# EAGLE design working (EAGLE 9.2.1)
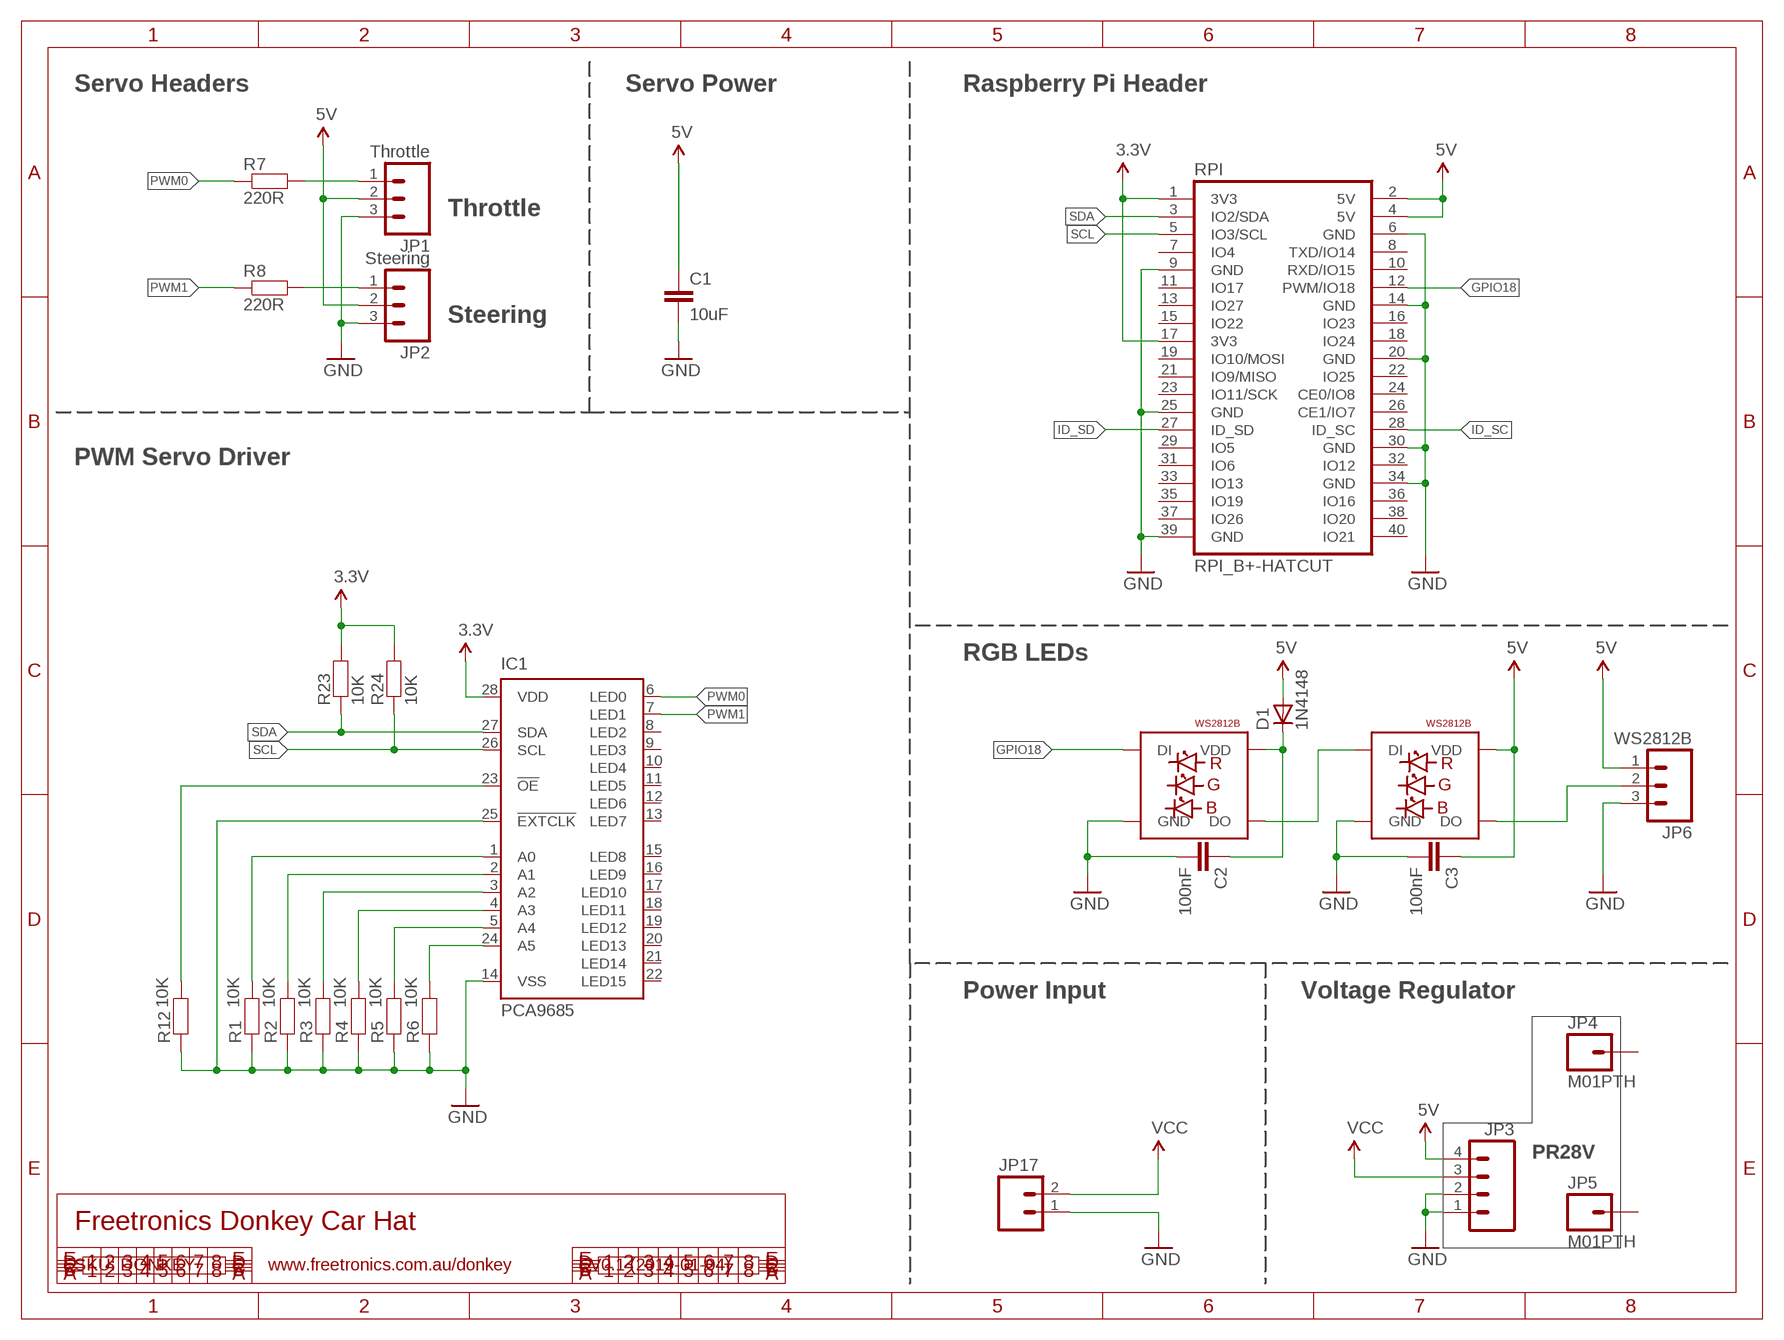
[diagram p0: schematic, sheet 1]

## Parts
C1  10uF  CAP0805  [0805]
C2  100nF  CAP0603  [0603]
C3  100nF  CAP0603  [0603]
D1  1N4148  DIODESOD  [SOD-323]
IC1  PCA9685  [TSSOP28]
JP1  Throttle  M03PTH  [1X03]
JP2  Steering  M03PTH  [1X03]
JP3  M04PTH  [1X04]
JP4  M01PTH  [1X01]
JP5  M01PTH  [1X01]
JP6  WS2812B  M03PTH  [1X03]
JP17  M025MM  [SCREWTERMINAL-5MM-2]
LED1  WS2812B5050  [WS2812B]
LED2  WS2812B5050  [WS2812B]
R1  10K  RESISTOR0603  [0603]
R2  10K  RESISTOR0603  [0603]
R3  10K  RESISTOR0603  [0603]
R4  10K  RESISTOR0603  [0603]
R5  10K  RESISTOR0603  [0603]
R6  10K  RESISTOR0603  [0603]
R7  220R  RESISTOR0603  [0603]
R8  220R  RESISTOR0603  [0603]
R12  10K  RESISTOR0603  [0603]
R23  10K  RESISTOR0603  [0603]
R24  10K  RESISTOR0603  [0603]
RPI  RPI_B+-HATCUT  [RPI-B+HAT_CUTOUT]

## Nets
3.3V: IC1.28(VDD) R23.2 R24.2 RPI.1(3V3) RPI.17(3V3)
5V: C1.1 C3.1 D1.2(A) JP1.2 JP2.2 JP3.4 JP6.1 LED2.1-VDD(VDD) RPI.2(5V) RPI.4(5V)
GND: C1.2 C2.2 C3.2 IC1.14(VSS) IC1.25(!EXTCLK) JP1.3 JP2.3 JP3.1 JP3.2 JP6.3 JP17.1 LED1.3-GND(GND) LED2.3-GND(GND) R1.1 R2.1 R3.1 R4.1 R5.1 R6.1 R12.1 RPI.6(GND) RPI.9(GND) RPI.14(GND) RPI.20(GND) RPI.25(GND) RPI.30(GND) RPI.34(GND) RPI.39(GND)
GPIO18: LED1.4-DIN(DI) RPI.12(PWM/IO18)
ID_SC: RPI.28(ID_SC)
ID_SD: RPI.27(ID_SD)
N$1: JP1.1 R7.2
N$2: JP2.1 R8.2
N$3: IC1.1(A0) R1.2
N$4: IC1.2(A1) R2.2
N$5: IC1.3(A2) R3.2
N$6: IC1.4(A3) R4.2
N$7: IC1.5(A4) R5.2
N$8: IC1.24(A5) R6.2
N$10: LED1.2-DOUT(DO) LED2.4-DIN(DI)
N$12: C2.1 D1.1(C) LED1.1-VDD(VDD)
N$14: JP6.2 LED2.2-DOUT(DO)
N$24: IC1.23(!OE) R12.2
PWM0: IC1.6(LED0) R7.1
PWM1: IC1.7(LED1) R8.1
SCL: IC1.26(SCL) R24.1 RPI.5(IO3/SCL)
SDA: IC1.27(SDA) R23.1 RPI.3(IO2/SDA)
VCC: JP3.3 JP17.2
Unconnected: IC1.8(LED2) IC1.9(LED3) IC1.10(LED4) IC1.11(LED5) IC1.12(LED6) IC1.13(LED7) IC1.15(LED8) IC1.16(LED9) IC1.17(LED10) IC1.18(LED11) IC1.19(LED12) IC1.20(LED13) IC1.21(LED14) IC1.22(LED15) JP4.1 JP5.1 RPI.7(IO4) RPI.8(TXD/IO14) RPI.10(RXD/IO15) RPI.11(IO17) RPI.13(IO27) RPI.15(IO22) RPI.16(IO23) RPI.18(IO24) RPI.19(IO10/MOSI) RPI.21(IO9/MISO) RPI.22(IO25) RPI.23(IO11/SCK) RPI.24(CE0/IO8) RPI.26(CE1/IO7) RPI.29(IO5) RPI.31(IO6) RPI.32(IO12) RPI.33(IO13) RPI.35(IO19) RPI.36(IO16) RPI.37(IO26) RPI.38(IO20) RPI.40(IO21)

## Notes on the sheet
- Raspberry Pi B+ | ID EEPROM
- Servo Headers | Servo Power | Raspberry Pi Header
- OnSemi CAT24C32 or Microchip 24LC32A
- Throttle
- Steering
- PWM Servo Driver
- RGB LEDs
- Power Input | Voltage Regulator
- PR28V
- Freetronics Donkey Car Hat
- SKU: DONKEY | www.freetronics.com.au/donkey | V0.1 (2019-01-04)

## Library data of the parts
C1-C3 = freetronics-jon:CAP: Capacitor Standard 0603 ceramic capacitor, and 0.1" leaded capacitor.
D1 = freetronics-jon:DIODE: Diode These are standard reverse protection diodes and small signal diodes. SMA package can handle up to about 1A. SOD-323 can handle about 200mA. What the SOD-323 package when ordering, there are some mfgs out there that are 5-pin packages.
IC1 = freetronics-jon:PCA9685
JP1 JP2 JP6 = freetronics-jon:M03: Header 3 Standard 3-pin 0.1" header. Use with straight break away headers (SKU : PRT-00116), right angle break away headers (PRT-00553), swiss pins (PRT-00743), machine pins (PRT-00117), and female headers (PRT-00115). Molex polarized connector foot print use with SKU : PRT-08232 with associated crimp pins and housings.
JP3 = freetronics-jon:M04: Header 4 Standard 4-pin 0.1" header. Use with straight break away headers (SKU : PRT-00116), right angle break away headers (PRT-00553), swiss pins (PRT-00743), machine pins (PRT-00117), and female headers (PRT-00115). Molex polarized connector foot print use with SKU : PRT-08231 with associated crimp pins and housings. 1MM SMD Version SKU: PRT-10208
JP4 JP5 = freetronics-jon:M01: Header 1 Standard 1-pin 0.1" header. Use with straight break away headers (SKU : PRT-00116), right angle break away headers (PRT-00553), swiss pins (PRT-00743), machine pins (PRT-00117), and female headers (PRT-00115).
JP17 = freetronics-jon:M02: Header 2 Standard 2-pin 0.1" header. Use with straight break away headers (SKU : PRT-00116), right angle break away headers (PRT-00553), swiss pins (PRT-00743), machine pins (PRT-00117), and female headers (PRT-00115). Molex polarized connector foot print use with SKU : PRT-08233 with associated crimp pins and housings.
LED1 LED2 = freetronics-jon:WS2812B
R1-R8 R12 R23 R24 = freetronics-jon:RESISTOR: Resistor Basic schematic elements and footprints for 0603, 1206, and PTH 1/10th watt (small) resistors.
RPI = we-board:RPI_B+: Raspberry Pi Model B+

## Net classes
0 default: width 0.203 mm, drill 0.356 mm, clearance 0.152 mm
1 power: width 0.203 mm, clearance 0.152 mm

## Board
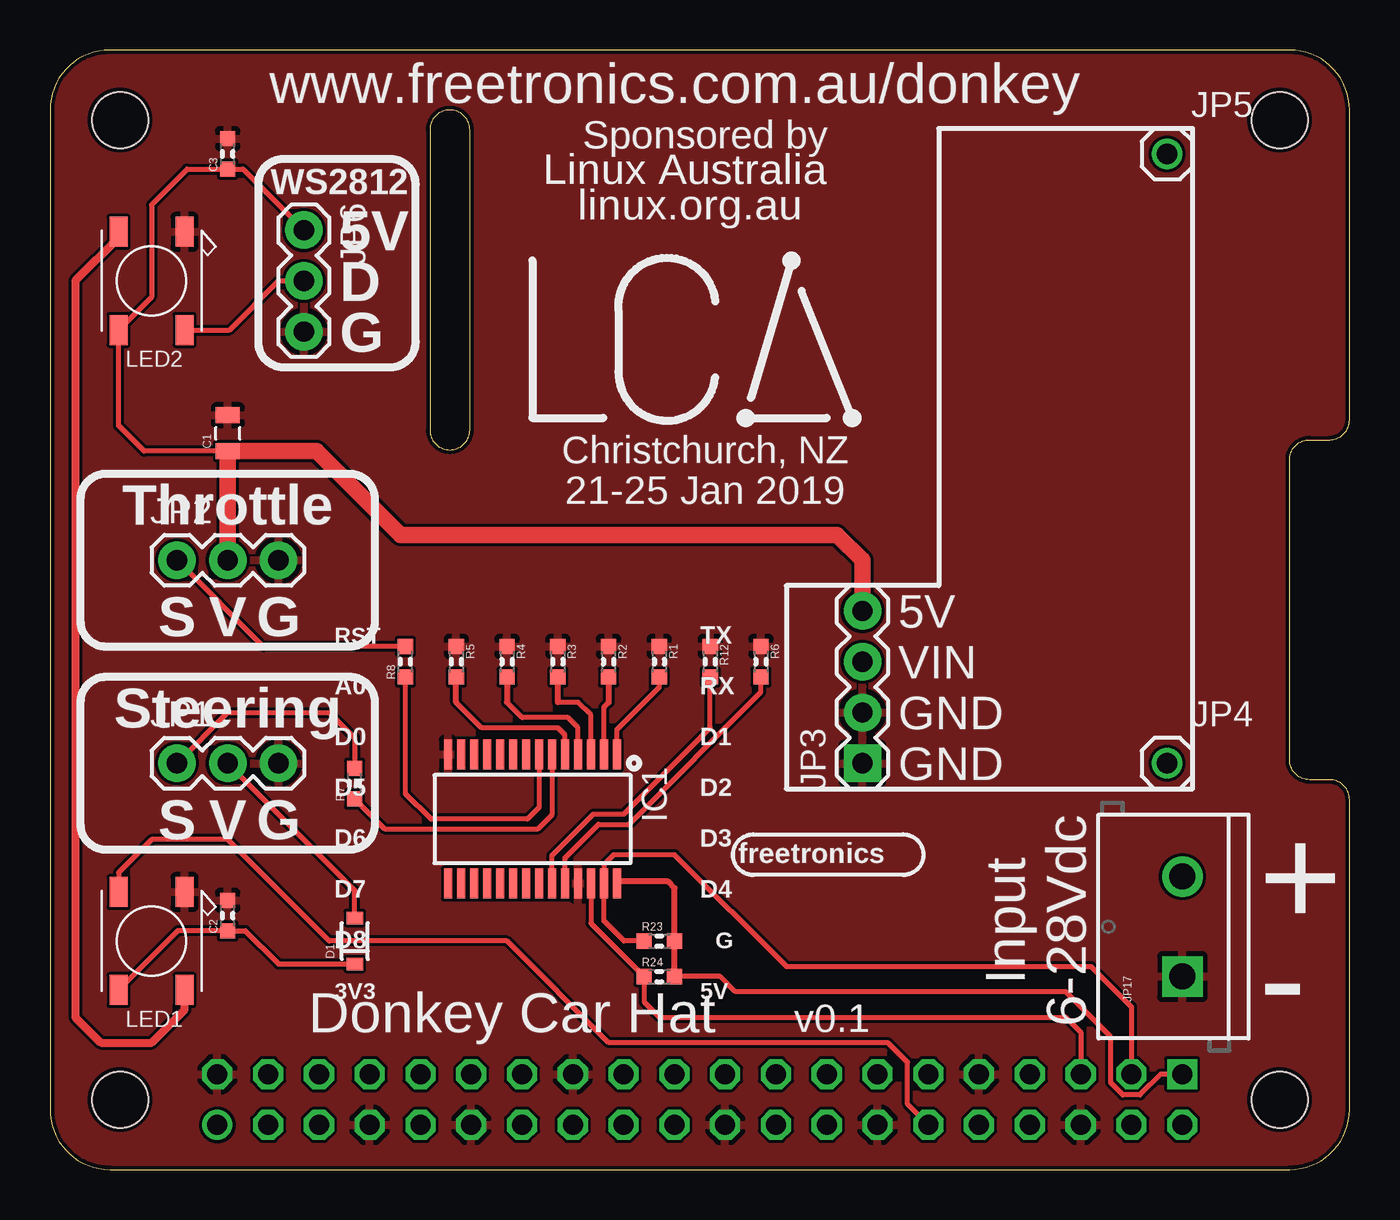
[diagram p1: board, top side]
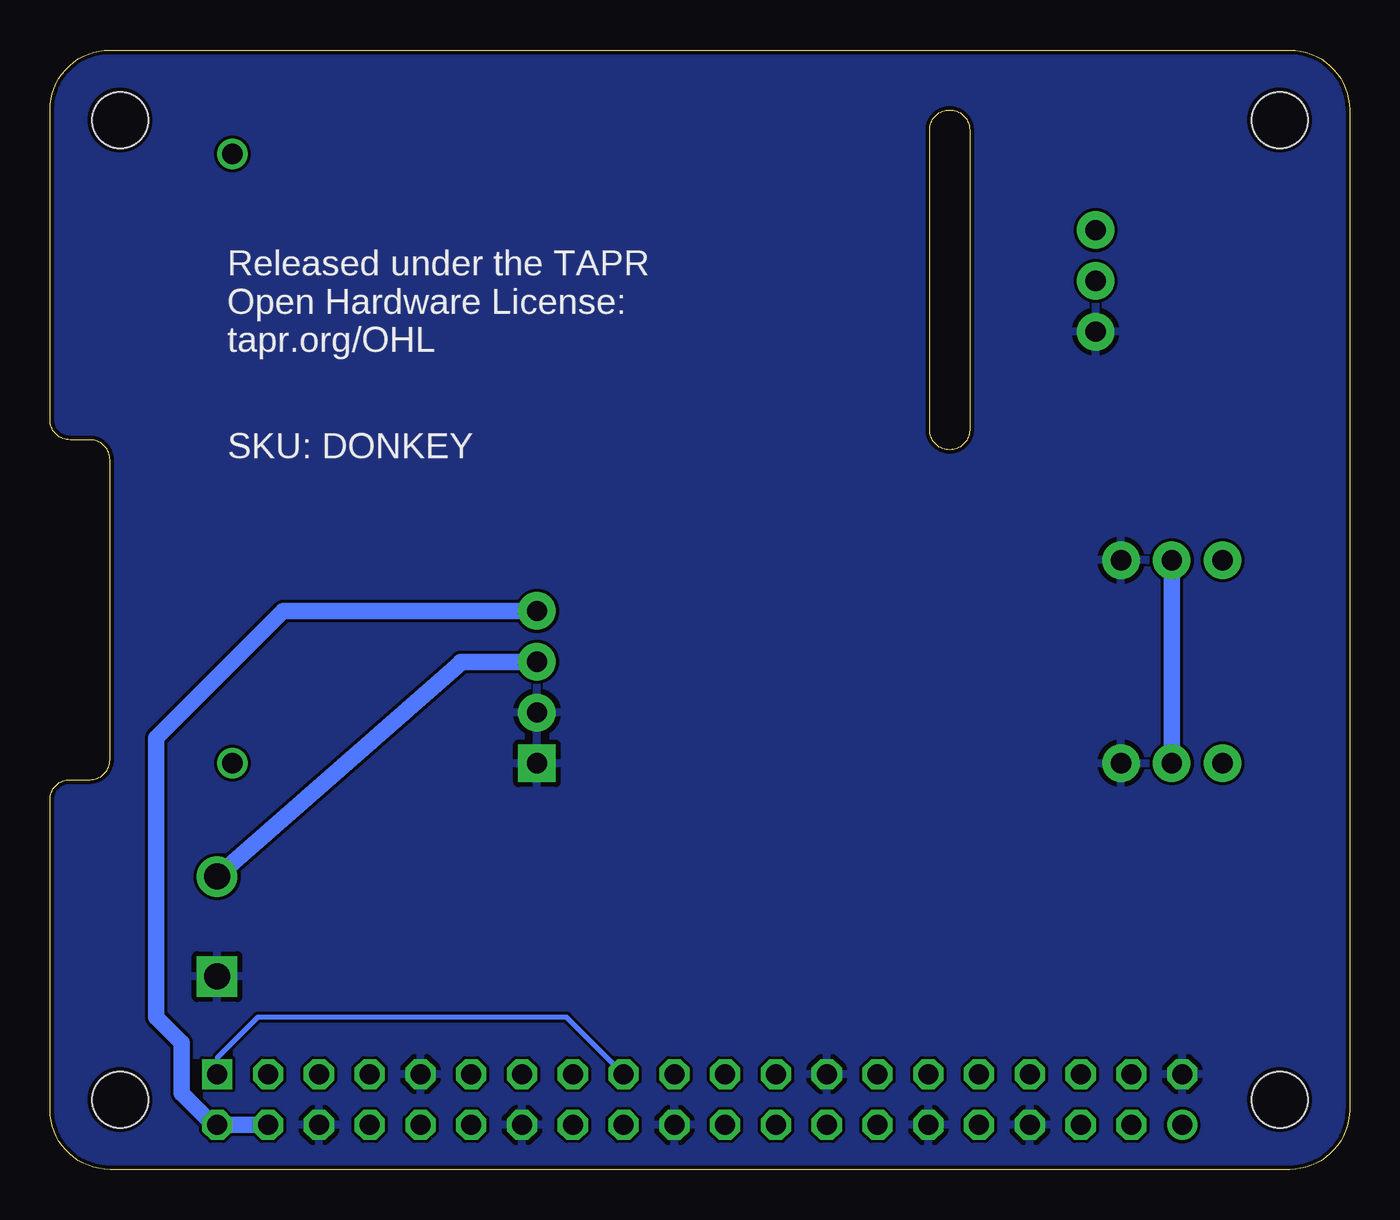
[diagram p2: board, bottom side, seen from below]

Size 65 x 56 mm. Coordinates in mm from the lower left corner, seen from the top.
Copper layers (1*16): Top 0.035mm / dielectric 1.5mm / Bottom 0.035mm
Design rules "ElectroDragon_2layer_DRU_no_angle_20140221": minimum track width 6mil, minimum drill 12mil, track to track 6mil, track to pad 6mil, pad to pad 6mil, via to via 6mil, smd to smd 6mil, copper to edge 8mil, drill to drill 6mil, minimum pad ring 10mil, minimum via ring 6mil, stop-mask expansion 4mil, vias tented up to drill 100mil, thermal gap 10mil

### Footprints (pad centres in the part's own frame; a part is rotated, then mirrored left to right if it is on the bottom)
0805 = smd 0.8 x 1.2: 1 -0.9,0; 2 0.9,0
0603 = smd 0.762 x 0.762: 1 -0.762,0; 2 0.762,0
SOD-323 = smd 0.63 x 0.83: 1 -1.15,0; 2 1.15,0
TSSOP28 = smd 0.4 x 1.5: 1 -4.225,-3.225; 2 -3.575,-3.225; 3 -2.925,-3.225; 4 -2.275,-3.225; 5 -1.625,-3.225; 6 -0.975,-3.225; 7 -0.325,-3.225; 8 0.325,-3.225; 9 0.975,-3.225; 10 1.625,-3.225; 11 2.275,-3.225; 12 2.925,-3.225; 13 3.575,-3.225; 14 4.225,-3.225; 15 4.225,3.225; 16 3.575,3.225; 17 2.925,3.225; 18 2.275,3.225; 19 1.625,3.225; 20 0.975,3.225; 21 0.325,3.225; 22 -0.325,3.225; 23 -0.975,3.225; 24 -1.625,3.225; 25 -2.275,3.225; 26 -2.925,3.225; 27 -3.575,3.225; 28 -4.225,3.225
1X03 = drill 1.016 pad 1.88: 1 0,0; 2 2.54,0; 3 5.08,0
1X04 = drill 1.016 pad 1.88 square: 1 0,0 | drill 1.016 pad 1.88: 2 2.54,0; 3 5.08,0; 4 7.62,0
1X01 = drill 1.016: 1 0,0
SCREWTERMINAL-5MM-2 = drill 1.3 pad 2.032 square: 1 0,0 | drill 1.3 pad 2.032: 2 5,0
WS2812B = smd 1.5 x 0.9: 1-VDD 2.45,-1.65; 2-DOUT 2.45,1.65; 3-GND -2.45,1.65; 4-DIN -2.45,-1.65
RPI-B+HAT_CUTOUT = drill 1 square: 1 56.63,4.77 | drill 1 octagon: 2 56.63,2.23; 3 54.09,4.77; 4 54.09,2.23; 5 51.55,4.77; 6 51.55,2.23; 7 49.01,4.77; 8 49.01,2.23; 9 46.47,4.77; 10 46.47,2.23; 11 43.93,4.77; 12 43.93,2.23; 13 41.39,4.77; 14 41.39,2.23; 15 38.85,4.77; 16 38.85,2.23; 17 36.31,4.77; 18 36.31,2.23; 19 33.77,4.77; 20 33.77,2.23; 21 31.23,4.77; 22 31.23,2.23; 23 28.69,4.77; 24 28.69,2.23; 25 26.15,4.77; 26 26.15,2.23; 27 23.61,4.77; 28 23.61,2.23; 29 21.07,4.77; 30 21.07,2.23; 31 18.53,4.77; 32 18.53,2.23; 33 15.99,4.77; 34 15.99,2.23; 35 13.45,4.77; 36 13.45,2.23; 37 10.91,4.77; 38 10.91,2.23; 39 8.37,4.77 | drill 1: 40 8.37,2.23 | hole 2.8: 3.5,3.5; 3.5,52.5; 61.5,52.5; 61.5,3.5

### Placement (x,y rotation side)
C1  8.89,36.83 90 top
C2  8.89,12.7 90 top
C3  8.89,50.8 90 top
D1  15.24,11.43 90 top
IC1  24.13,17.53 180 top
JP1  6.35,20.32 0 top
JP2  6.35,30.48 0 top
JP3  40.64,20.32 90 top
JP4  55.88,20.32 0 top
JP5  55.88,50.8 0 top
JP6  12.7,46.99 270 top
JP17  56.64,9.65 90 top
LED1  5.08,11.43 270 top
LED2  5.08,44.45 270 top
R1  30.48,25.4 270 top
R2  27.94,25.4 270 top
R3  25.4,25.4 270 top
R4  22.86,25.4 270 top
R5  20.32,25.4 270 top
R6  35.56,25.4 270 top
R7  15.24,19.3 90 top
R8  17.78,25.4 90 top
R12  33.02,25.4 270 top
R23  30.48,11.43 0 top
R24  30.48,9.65 0 top
RPI  0,0 0 top

### Tracks (layer width: path | path; a pad name or v marks a point on that pad's centre or on a via)
3.3V
  Top 0.254: RPI.1 55.55,4.77 54.52,3.74 53.66,3.74 53.06,4.34 53.06,6.63 50.8,8.89 34.29,8.89 33.53,9.65 R24.2
  Top 0.305: R24.2 R23.2 31.24,14.07 30.91,14.4 28.45,14.4 IC1.28
  Bottom 0.254: RPI.17 39.16,7.62 54.61,7.62 56.63,5.6 RPI.1
5V
  Top 0.254: D1.2 15.24,13.97 JP1.2 | JP6.1 9.65,50.04 C3.1 6.86,50.04 5.08,48.26 5.08,43.65 LED2.1-VDD 3.43,37.21 4.71,35.93 C1.1
  Top 0.813: JP3.4 40.64,30.48 39.37,31.75 17.53,31.75 13.35,35.93 C1.1 JP2.2
  Bottom 0.813: JP2.2 JP1.2 | RPI.4 RPI.2 56.84,2.23 58.42,3.81 58.42,6.35 59.69,7.62 59.69,21.59 53.34,27.94 JP3.4
GND
  pour Top: 0,0 0,55.88 66.04,55.88 66.04,0
  pour Bottom: 0,0 0,55.88 66.04,55.88 66.04,0
GPIO18
  Top 0.254: RPI.12 42.9,3.26 42.9,5.36 41.91,6.35 27.94,6.35 22.86,11.43 13.97,11.43 8.89,16.51 5.08,16.51 3.43,14.86 LED1.4-DIN
N$1
  Top 0.254: JP1.1 8.89,22.86 13.97,22.86 15.24,21.59 R7.2
N$2
  Top 0.254: R8.2 10.67,26.16 JP2.1
N$3
  Top 0.254: IC1.1 28.36,22 30.48,24.13 R1.2
N$4
  Top 0.254: IC1.2 27.7,23.13 27.94,23.37
  Top 0.305: R2.2 27.94,23.37
N$5
  Top 0.254: IC1.3 27.05,22.73 26.42,23.37 25.4,23.37
  Top 0.305: 25.4,23.37 R3.2
N$6
  Top 0.254: IC1.4 26.41,22.11 25.91,22.61 23.62,22.61 22.86,23.37
  Top 0.305: R4.2 22.86,23.37
N$7
  Top 0.254: IC1.5 25.75,21.74 25.4,22.1 21.59,22.1 20.32,23.37
  Top 0.305: 20.32,23.37 R5.2
N$8
  Top 0.254: IC1.24 25.75,15.6 27.43,17.27 28.96,17.27 35.56,23.88 R6.2
N$10
  Top 0.406: LED2.4-DIN 3.43,46.61 1.27,44.45 1.27,7.62 2.54,6.35 5.08,6.35 6.73,8 LED1.2-DOUT
N$12
  Top 0.254: LED1.1-VDD 6.39,11.94 C2.1 9.77,11.94 11.43,10.28 D1.1
N$14
  Top 0.254: LED2.2-DOUT 8.98,42 11.43,44.45 JP6.2
N$24
  Top 0.254: IC1.23 25.11,15.71 27.18,17.78 28.7,17.78 33.02,22.1 R12.2
PWM0
  Top 0.254: IC1.6 25.11,17.74 24.38,17.02 16.76,17.02 R7.1
PWM1
  Top 0.254: IC1.7 24.45,18.11 23.88,17.53 19.05,17.53 17.78,18.8 R8.1
SCL
  Top 0.254: IC1.26 27.05,12.31 R24.1 29.72,8.38 30.48,7.62 50.8,7.62 51.55,6.87 RPI.5
SDA
  Top 0.254: R23.1 28.7,11.43 27.7,12.43 IC1.27 27.7,15.26 28.19,15.75 31.24,15.75 36.83,10.16 52.07,10.16 54.09,8.14 RPI.3
VCC
  Bottom 0.813: JP17.2 44.45,25.34 44.45,25.4 JP3.3

### Text on the board
tPlace: www.freetronics.com.au/donkey | Sponsored by | WS2812 | Linux Australia | 5V | linux.org.au | D | G | Christchurch, NZ | 21-25 Jan 2019 | Throttle | 5V | S | V | G | VIN | GND | Steering | GND | S | V | G | freetronics | Input / 6-28Vdc | + | Donkey Car Hat | v0.1 | -
bPlace: Released under the TAPR / Open Hardware License: / tapr.org/OHL | SKU: DONKEY
tNames: RST | TX | A0 | RX | D0 | D1 | D5 | D2 | D6 | D3 | D7 | D4 | D8 | G | 3V3 | 5V